# EAGLE design final_schematic (EAGLE 9.6.2)
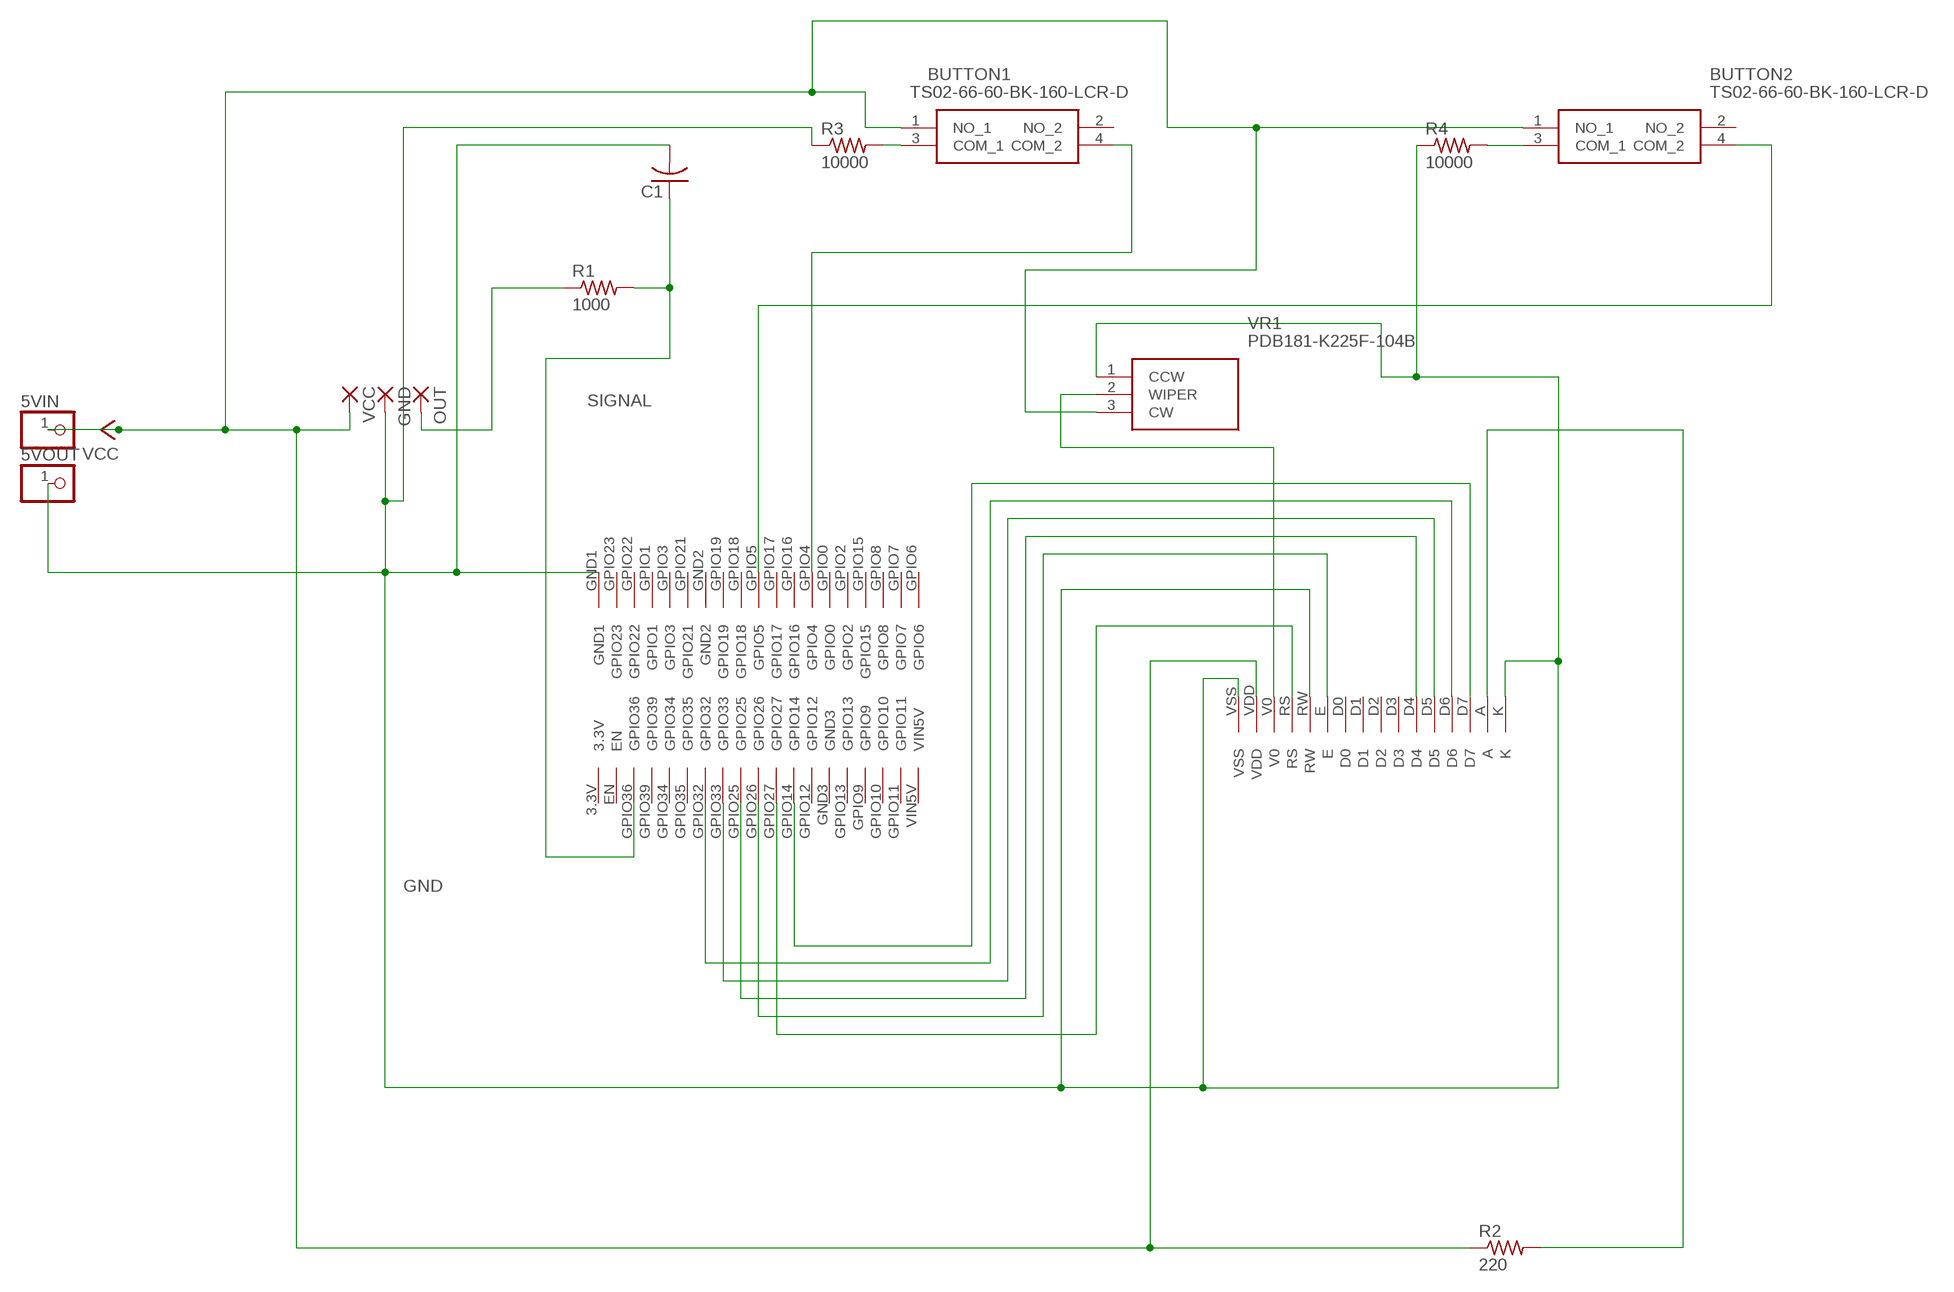
[diagram p0: schematic, sheet 1]

## Parts
5VIN  PINHD-1X1  [1X01]
5VOUT  PINHD-1X1  [1X01]
BUTTON1  TS02-66-60-BK-160-LCR-D  [TS026660BK160LCRD]
BUTTON2  TS02-66-60-BK-160-LCR-D  [TS026660BK160LCRD]
C1  C-USC0805  [C0805]
GND  1,6/0,8  [1,6/0,8]
OUT  1,6/0,8  [1,6/0,8]
R1  1000  R-US_R0805  [R0805]
R2  220  R-US_R0805  [R0805]
R3  10000  R-US_R0805  [R0805]
R4  10000  R-US_R0805  [R0805]
U$1  HILETGO  [HILETGO]
U$2  LCD  [LCD]
VCC  1,6/0,8  [1,6/0,8]
VR1  PDB181-K225F-104B  [PDB181K225F104B]

## Nets
GND: 5VOUT.1 C1.2 GND.1(P) R3.1 R4.1 U$1.GND1 U$2.K U$2.RW U$2.VSS VR1.1(CCW)
N$1: BUTTON1.4(COM_2) U$1.GPIO4
N$2: OUT.1(P) R1.1
N$4: U$1.GPIO27 U$2.RS
N$5: U$1.GPIO33 U$2.D5
N$6: U$1.GPIO26 U$2.E
N$7: U$1.GPIO25 U$2.D4
N$8: U$1.GPIO32 U$2.D6
N$9: U$1.GPIO14 U$2.D7
N$10: R2.2 U$2.A
N$11: BUTTON1.3(COM_1) R3.2
N$13: BUTTON2.3(COM_1) R4.2
N$15: BUTTON2.4(COM_2) U$1.GPIO5
N$17: U$2.V0 VR1.2(WIPER)
SIGNAL: C1.1 R1.2 U$1.GPIO36
VCC: 5VIN.1 BUTTON1.1(NO_1) BUTTON2.1(NO_1) R2.1 U$2.VDD VCC.1(P) VR1.3(CW)
Unconnected: BUTTON1.2(NO_2) BUTTON2.2(NO_2) U$1.3.3V U$1.EN U$1.GND2 U$1.GND3 U$1.GPIO0 U$1.GPIO1 U$1.GPIO2 U$1.GPIO3 U$1.GPIO6 U$1.GPIO7 U$1.GPIO8 U$1.GPIO9 U$1.GPIO10 U$1.GPIO11 U$1.GPIO12 U$1.GPIO13 U$1.GPIO15 U$1.GPIO16 U$1.GPIO17 U$1.GPIO18 U$1.GPIO19 U$1.GPIO21 U$1.GPIO22 U$1.GPIO23 U$1.GPIO34 U$1.GPIO35 U$1.GPIO39 U$1.VIN5V U$2.D0 U$2.D1 U$2.D2 U$2.D3

## Library data of the parts
5VIN 5VOUT = pinhead:PINHD-1X1: PIN HEADER
BUTTON1 BUTTON2 = TS02-66-60-BK-160-LCR-D:TS02-66-60-BK-160-LCR-D: 6 x 6 mm, 6 mm Actuator Height, 160 gf, Black, Long Crimped, Through Hole, SPST, Tactile Switch Source: Datasheet <https://www.sameskydevices.com/product/resource/ts02.pdf>; DESCRIPTION: 6 x 6 mm, 6 mm Actuator Height, 160 gf, Black, Long Crimped, Through Hole, SPST, Tactile Switch; HEIGHT: 6.2mm; MANUFACTURER_NAME: Same Sky; MANUFACTURER_PART_NUMBER: TS02-66-60-BK-160-LCR-D; MOUSER_PART_NUMBER: 179-TS026660BK160LCR; MOUSER_PRICE-STOCK: https://www.mouser.co.uk/ProductDetail/Same-Sky/TS02-66-60-BK-160-LCR-D?qs=A6eO%252BMLsxmT2go%252BgKJKEow%3D%3D
C1 = rcl:C-US: CAPACITOR, American symbol; SPICEPREFIX: C
GND OUT VCC = wirepad:1,6/0,8: THROUGH-HOLE PAD
R1-R4 = rcl:R-US_: RESISTOR, American symbol; SPICEPREFIX: R
U$1 = ESP32_HILETGO_2x19_Header:HILETGO
U$2 = lcd:LCD
VR1 = PDB181-K225F-104B:PDB181-K225F-104B: 100k Ohm 1 Gang Linear Through Hole Potentiometer 1.0 Turns Carbon 0.2W, 1/5W PC Pins Source: Datasheet <https://www.bourns.com/docs/Product-Datasheets/PDB18.pdf>; DESCRIPTION: 100k Ohm 1 Gang Linear Through Hole Potentiometer 1.0 Turns Carbon 0.2W, 1/5W PC Pins; HEIGHT: 21mm; MANUFACTURER_NAME: Bourns; MANUFACTURER_PART_NUMBER: PDB181-K225F-104B; MOUSER_PART_NUMBER: 652-PDB181-K225F104B; MOUSER_PRICE-STOCK: https://www.mouser.co.uk/ProductDetail/Bourns/PDB181-K225F-104B?qs=TCDPyi3sCW13cuOB%252BYjZJA%3D%3D

## Board
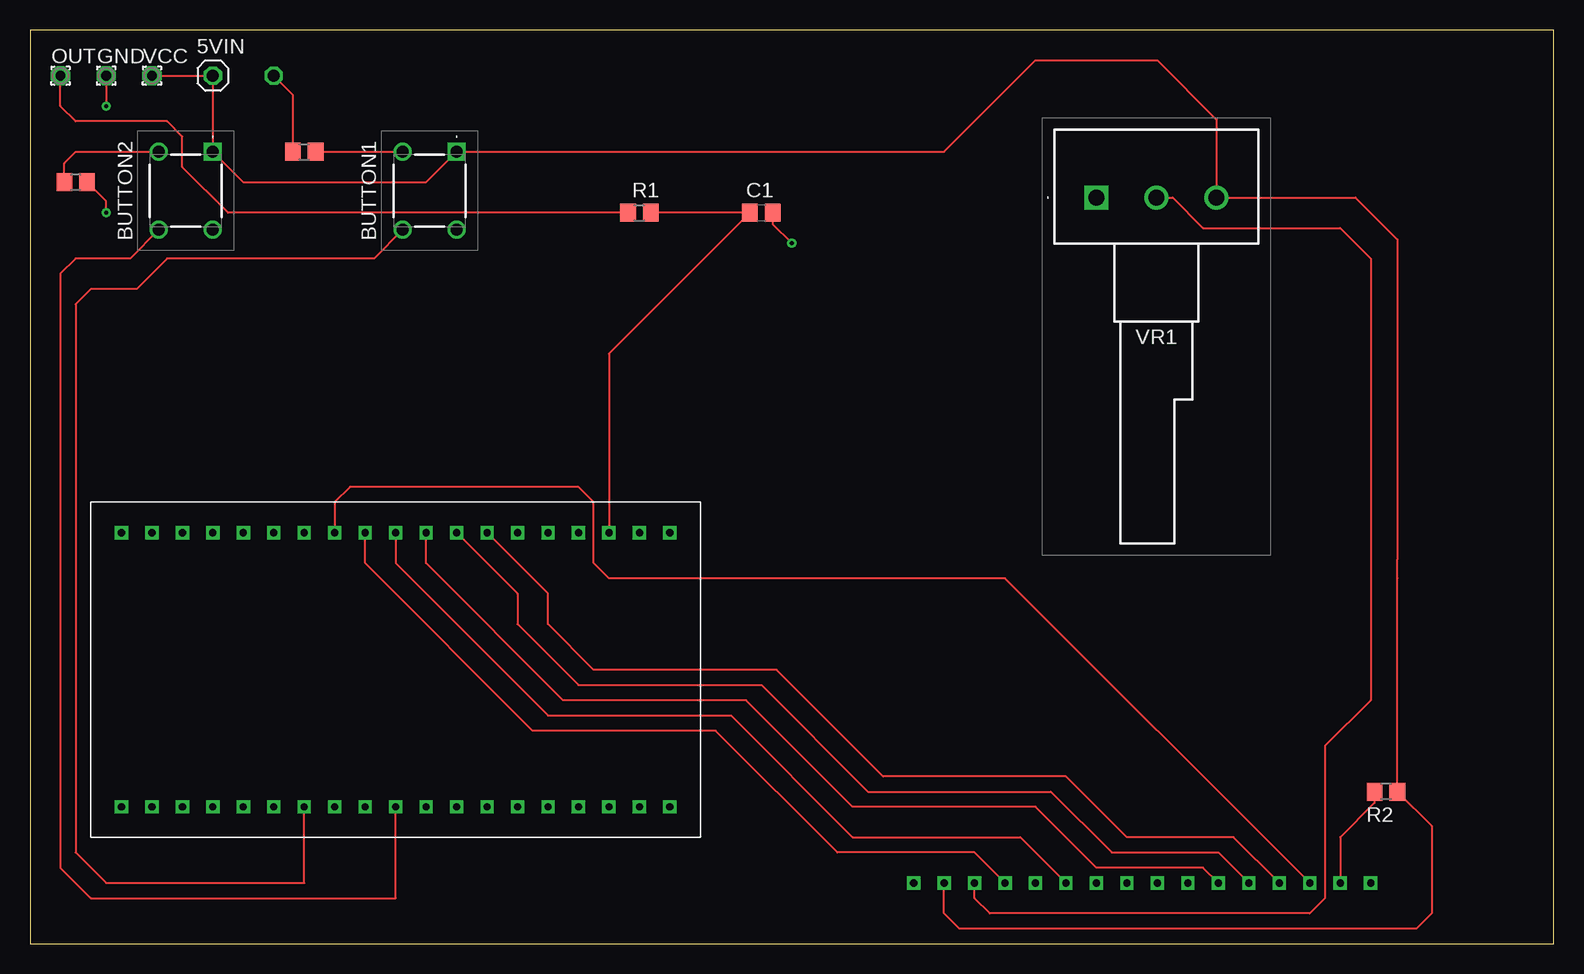
[diagram p1: board, top side]
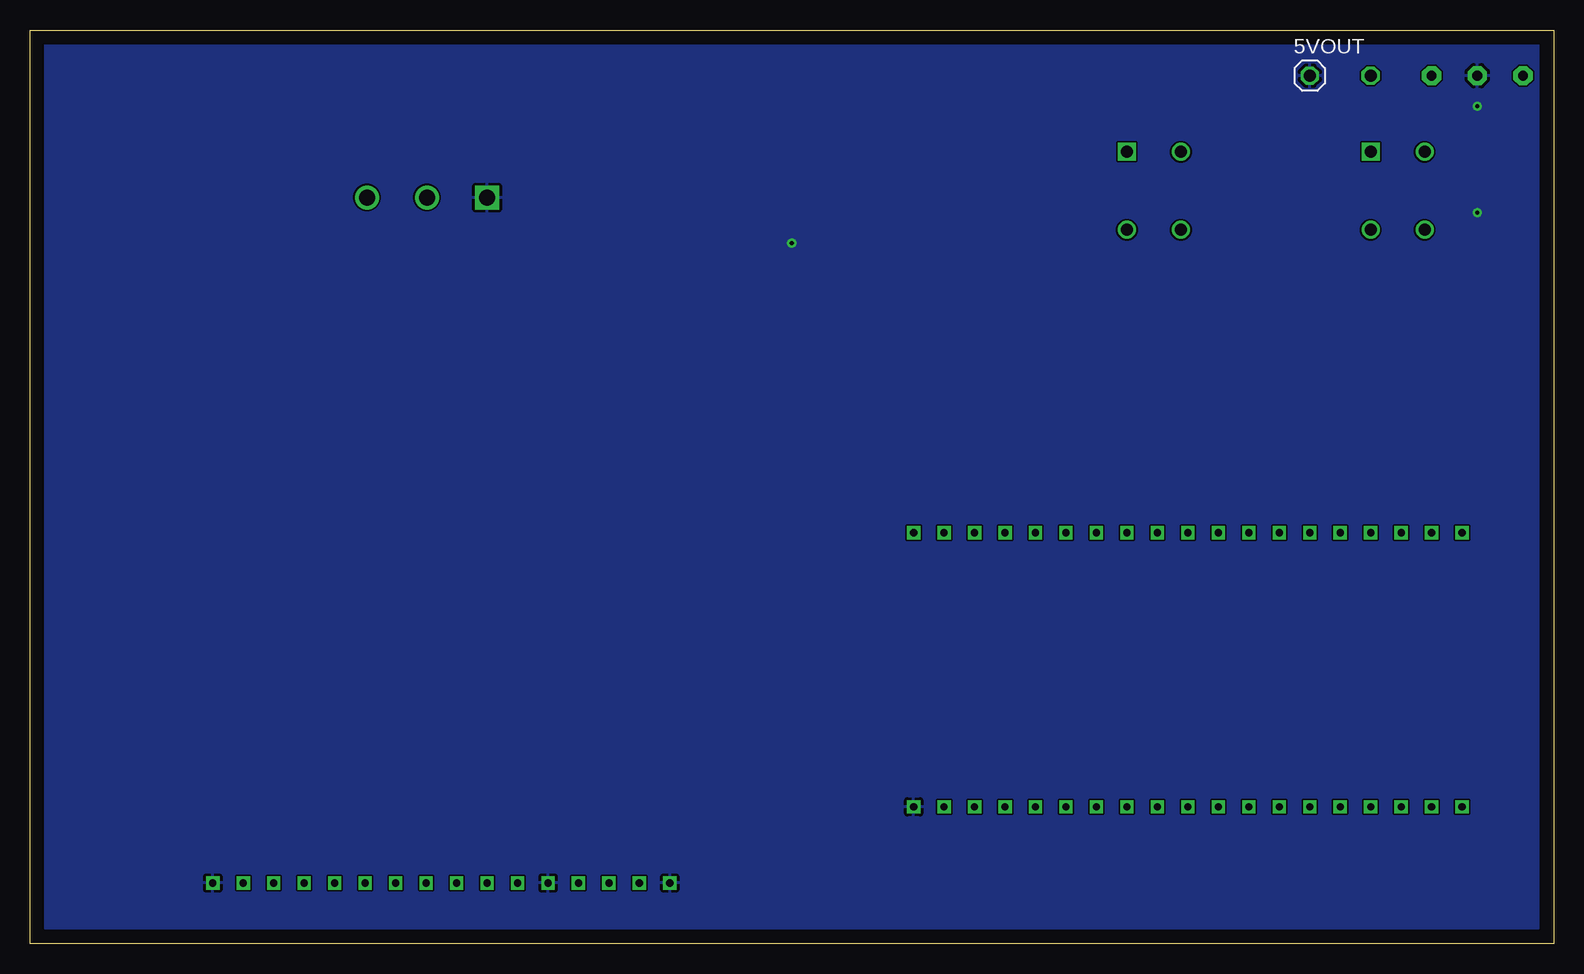
[diagram p2: board, bottom side, seen from below]

Size 127 x 76.2 mm. Coordinates in mm from the lower left corner, seen from the top.
Outline: 0,0 127,0 127,76.2 0,76.2 0,0
Copper layers (1*16): Top 0.035mm / dielectric 1.5mm / Bottom 0.035mm
Design rules "default": minimum track width 6mil, minimum drill 0.35mm, track to track 6mil, track to pad 6mil, pad to pad 6mil, via to via 6mil, smd to smd 6mil, copper to edge 40mil, drill to drill 6mil, minimum pad ring 10mil, minimum via ring 8mil, stop-mask expansion 4mil, vias tented up to drill 0mil, thermal gap 10mil

### Footprints (pad centres in the part's own frame; a part is rotated, then mirrored left to right if it is on the bottom)
1X01 = drill 1.016 octagon: 1 0,0
TS026660BK160LCRD = drill 1 pad 1.5 square: 1 0,0 | drill 1 pad 1.5: 2 6.5,0; 3 0,-4.5; 4 6.5,-4.5
C0805 = smd 1.3 x 1.5: 1 -0.95,0; 2 0.95,0
1,6/0,8 = drill 0.813 pad 1.6 octagon: 1 0,0
R0805 = smd 1.3 x 1.5: 1 -0.95,0; 2 0.95,0
HILETGO = drill 0.6 square: 3.3V 0,0; EN 2.54,0; GND1 0,22.86; GND2 15.24,22.86; GND3 33.02,0; GPIO0 33.02,22.86; GPIO1 7.62,22.86; GPIO2 35.56,22.86; GPIO3 10.16,22.86; GPIO4 30.48,22.86; GPIO5 22.86,22.86; GPIO6 45.72,22.86; GPIO7 43.18,22.86; GPIO8 40.64,22.86; GPIO9 38.1,0; GPIO10 40.64,0; GPIO11 43.18,0; GPIO12 30.48,0; GPIO13 35.56,0; GPIO14 27.94,0; GPIO15 38.1,22.86; GPIO16 27.94,22.86; GPIO17 25.4,22.86; GPIO18 20.32,22.86; GPIO19 17.78,22.86; GPIO21 12.7,22.86; GPIO22 5.08,22.86; GPIO23 2.54,22.86; GPIO25 20.32,0; GPIO26 22.86,0; GPIO27 25.4,0; GPIO32 15.24,0; GPIO33 17.78,0; GPIO34 10.16,0; GPIO35 12.7,0; GPIO36 5.08,0; GPIO39 7.62,0; VIN5V 45.72,0
LCD = drill 0.6 square: A 35.56,0; D0 15.24,0; D1 17.78,0; D2 20.32,0; D3 22.86,0; D4 25.4,0; D5 27.94,0; D6 30.48,0; D7 33.02,0; E 12.7,0; K 38.1,0; RS 7.62,0; RW 10.16,0; V0 5.08,0; VDD 2.54,0; VSS 0,0
PDB181K225F104B = drill 1.32 pad 1.98 square: 1 0,0 | drill 1.32 pad 1.98: 2 5,0; 3 10,0

### Placement (x,y rotation side)
5VIN  15.24,72.39 0 top
5VOUT  20.32,72.39 0 bottom
BUTTON1  35.56,66.04 270 top
BUTTON2  15.24,66.04 270 top
C1  60.96,60.96 0 top
GND  6.35,72.39 0 top
OUT  2.54,72.39 0 top
R1  50.8,60.96 0 top
R2  113.03,12.7 180 top
R3  22.86,66.04 0 top
R4  3.81,63.5 180 top
U$1  53.34,34.29 180 top
U$2  73.66,5.08 0 top
VCC  10.16,72.39 0 top
VR1  88.9,62.23 0 top

### Tracks (layer width: path | path; a pad name or v marks a point on that pad's centre or on a via)
GND  (via drill 0.35)
  Top 0.152: GND.1 v6.35,69.85 | R4.1 6.35,61.91 v6.35,60.96 | C1.2 61.91,60.01 v63.5,58.42 | 5VOUT.1 21.91,70.8 R3.1
  pour Bottom: 1.27,74.93 1.27,1.27 125.73,1.27 125.73,74.93
N$1
  Top 0.152: U$1.GPIO4 22.86,5.08 6.35,5.08 3.81,7.62 3.81,53.34 5.08,54.61 8.89,54.61 11.43,57.15 28.67,57.15 BUTTON1.4
N$2
  Top 0.152: R1.1 16.51,60.96 12.7,64.77 12.7,67.31 11.43,68.58 3.81,68.58 2.54,69.85 OUT.1
N$4
  Top 0.152: U$2.RS 78.74,7.62 67.31,7.62 57.15,17.78 41.91,17.78 27.94,31.75 U$1.GPIO27
N$5
  Top 0.152: U$1.GPIO33 40.64,29.21 40.64,26.67 45.72,21.59 60.96,21.59 69.85,12.7 85.09,12.7 90.17,7.62 99.06,7.62 U$2.D5
N$6
  Top 0.152: U$1.GPIO26 30.48,31.75 43.18,19.05 58.42,19.05 68.58,8.89 82.55,8.89 U$2.E
N$7
  Top 0.152: U$2.D4 97.79,6.35 88.9,6.35 83.82,11.43 68.58,11.43 59.69,20.32 44.45,20.32 33.02,31.75 U$1.GPIO25
N$8
  Top 0.152: U$2.D6 100.33,8.89 91.44,8.89 86.36,13.97 71.12,13.97 62.23,22.86 46.99,22.86 43.18,26.67 43.18,29.21 U$1.GPIO32
N$9
  Top 0.152: U$2.D7 81.28,30.48 48.26,30.48 46.99,31.75 46.99,36.83 45.72,38.1 26.67,38.1 25.4,36.83 U$1.GPIO14
N$10
  Top 0.152: R2.2 112.08,11.75 109.22,8.89 U$2.A
N$11
  Top 0.152: R3.2 BUTTON1.3
N$13
  Top 0.152: R4.2 2.86,65.09 3.81,66.04 BUTTON2.3
N$15
  Top 0.152: U$1.GPIO5 30.48,3.81 5.08,3.81 2.54,6.35 2.54,55.88 3.81,57.15 8.35,57.15 BUTTON2.4
N$17
  Top 0.152: U$2.V0 78.74,3.81 80.01,2.54 106.68,2.54 107.95,3.81 107.95,10.16 107.95,16.51 111.76,20.32 111.76,57.15 109.22,59.69 97.79,59.69 95.25,62.23 VR1.2
SIGNAL
  Top 0.152: R1.2 C1.1 48.26,49.21 U$1.GPIO36
VCC
  Top 0.152: U$2.VDD 76.2,2.54 77.47,1.27 115.57,1.27 116.84,2.54 116.84,9.84 R2.1 113.98,30.48 113.98,32.07 113.98,58.74 110.49,62.23 VR1.3 98.9,68.74 93.98,73.66 83.82,73.66 76.2,66.04 BUTTON1.1 33.02,63.5 17.78,63.5 BUTTON2.1 5VIN.1 VCC.1